# Altium schematic sheet TRAY5.SchDoc
size A4
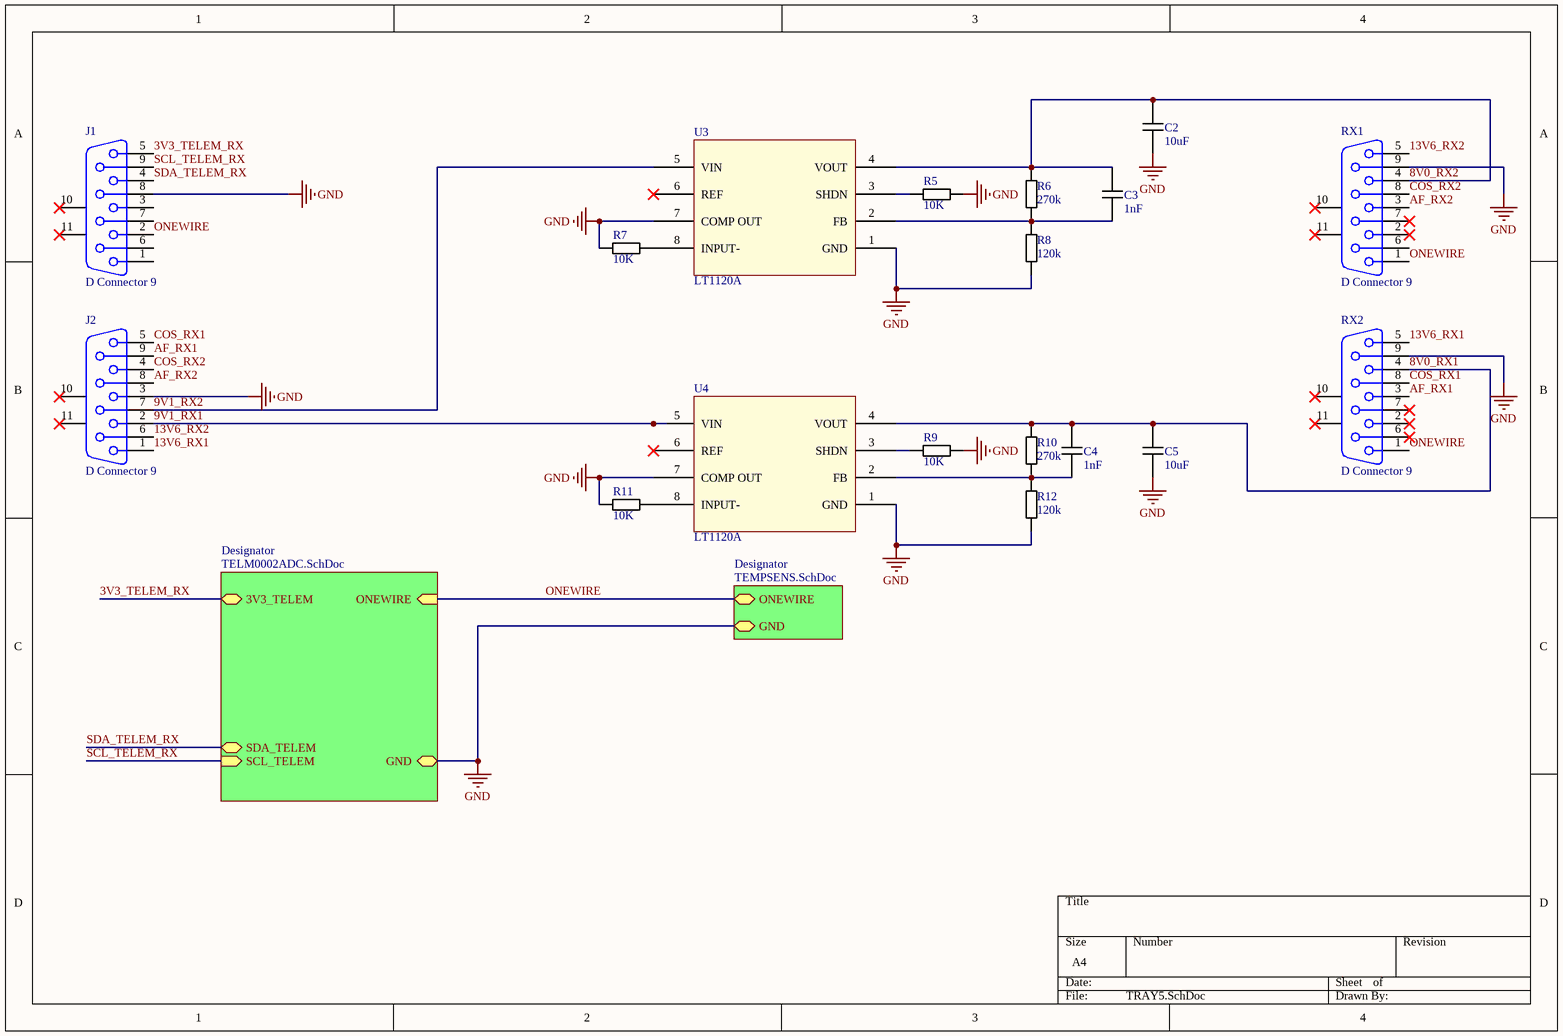
[diagram p0: TRAY5.SchDoc]

## Parts
C2  value 10uF  [0805 Cap]  (hidden comment: 0805 Cap)
C3  value 1nF  [0805 Cap]  (hidden comment: 0805 Cap)
C4  value 1nF  [0805 Cap]  (hidden comment: 0805 Cap)
C5  value 10uF  [0805 Cap]  (hidden comment: 0805 Cap)
J1  D Connector 9  [DSUB1.385-2H9]
J2  D Connector 9  [DSUB1.385-2H9]
R5  value 10K  [0805 Resistor]  (hidden comment: 0805 Resistor)
R6  value 270k  [0805 Resistor]  (hidden comment: 0805 Resistor)
R7  value 10K  [0805 Resistor]  (hidden comment: 0805 Resistor)
R8  value 120k  [0805 Resistor]  (hidden comment: 0805 Resistor)
R9  value 10K  [0805 Resistor]  (hidden comment: 0805 Resistor)
R10  value 270k  [0805 Resistor]  (hidden comment: 0805 Resistor)
R11  value 10K  [0805 Resistor]  (hidden comment: 0805 Resistor)
R12  value 120k  [0805 Resistor]  (hidden comment: 0805 Resistor)
RX1  D Connector 9  [DSUB Upright]
RX2  D Connector 9  [DSUB Upright]
U3  LT1120A  [SOIC8 - LT1120A]
U4  LT1120A  [SOIC8 - LT1120A]

## Sub-sheets
Designator = TELM0002ADC.SchDoc: SDA_TELEM (bidir), SCL_TELEM (in), ONEWIRE (in), 3V3_TELEM, GND
Designator = TEMPSENS.SchDoc: GND, ONEWIRE (bidir)

## Nets
GND: C2.1 C5.1 J1.8 J2.3 R5.2 R7.1 R8.1 R9.2 R11.1 R12.1 RX1.9 RX2.9 U3.1(GND) U3.7(COMP_OUT) U4.1(GND) U4.7(COMP_OUT) ; sheet Designator/GND, sheet Designator/GND
3V3_TELEM_RX: J1.5 ; sheet Designator/3V3_TELEM
8V0_RX1: C4.2 C5.2 R10.2 RX2.4 U4.4(VOUT)
8V0_RX2: C2.2 C3.2 R6.2 RX1.4 U3.4(VOUT)
9V1_RX1: J2.2 U4.5(VIN)
9V1_RX2: J2.7 U3.5(VIN)
13V6_RX1: J2.1 RX2.5
13V6_RX2: J2.6 RX1.5
AF_RX1: J2.9 RX2.3
AF_RX2: J2.8 RX1.3
COS_RX1: J2.5 RX2.8
COS_RX2: J2.4 RX1.8
ONEWIRE: J1.2 RX1.1 RX2.1 ; sheet Designator/ONEWIRE, sheet Designator/ONEWIRE
SCL_TELEM_RX: J1.9 ; sheet Designator/SCL_TELEM
SDA_TELEM_RX: J1.4 ; sheet Designator/SDA_TELEM
NetC3_1: C3.1 R6.1 R8.2 U3.2(FB)
NetC4_1: C4.1 R10.1 R12.2 U4.2(FB)
NetR5_1: R5.1 U3.3(SHDN)
NetR7_2: R7.2 U3.8(INPUT-)
NetR9_1: R9.1 U4.3(SHDN)
NetR11_2: R11.2 U4.8(INPUT-)

Not connected (* = marked no-connect by the designer): J1 1 3 6 7 10(MH1)* 11(MH2)*; J2 10(MH1)* 11(MH2)*; RX1 2* 6 7* 10(MH1)* 11(MH2)*; RX2 2* 6* 7* 10(MH1)* 11(MH2)*; U3 6(REF)*; U4 6(REF)*

## Library data of the parts
C2-C5 = 0805 MLCC - NP0, 5%: Supplier: Digikey
  C2 C5: Supplier P/N: JMK212AB7106KG-T
  C3 C4: Supplier P/N: UMK212B7105KG-T
J1 J2 RX1 RX2 = D Connector 9: Receptacle Assembly, 9 Position, Right Angle; Supplier: Digikey
R5-R12 = 0805 Thick Film Resistor 1%: Supplier: Digikey
  R6 R10: Supplier P/N: RC0805FR-07270KL
  R8 R12: Supplier P/N: RC0805FR-07120KL
U3 U4 = LT1120A: Supplier: Digikey; Supplier P/N: LT1120ACS8#PBF-ND